# EasyEDA Pro project pcb easy eda pro stm32wb5mmg01 - Elektor.eprj, board PCB5
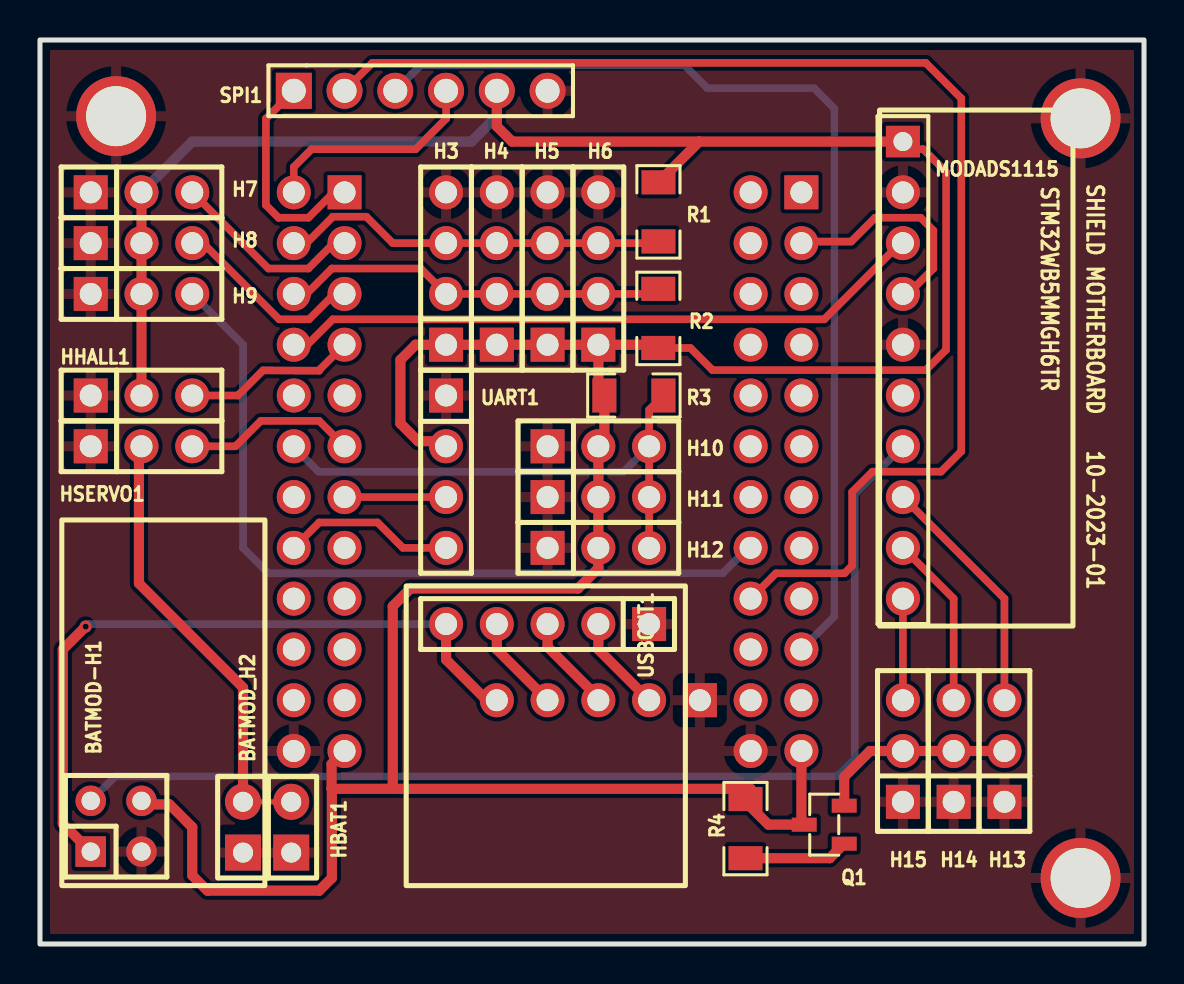
[diagram p5: board, top side]
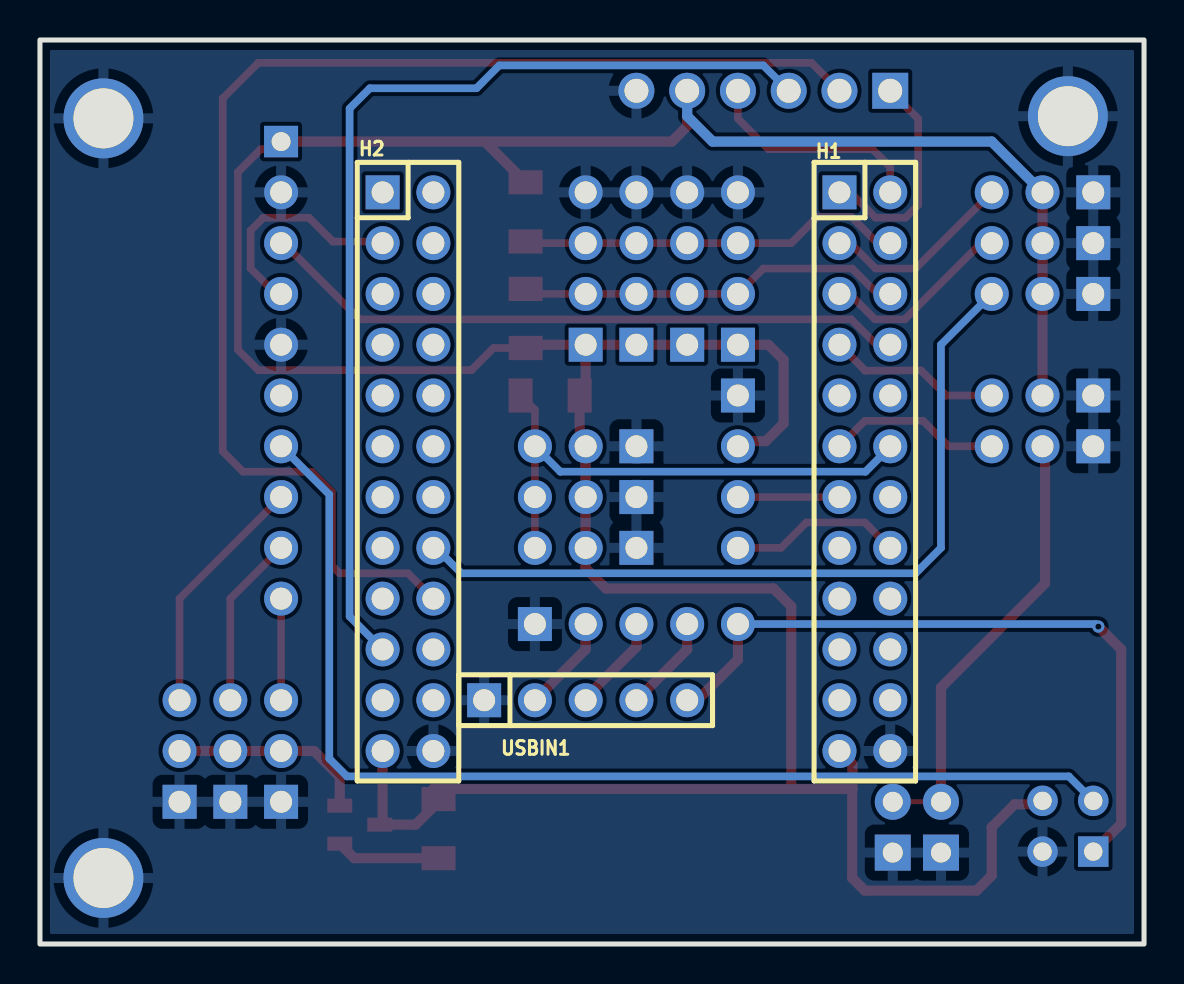
[diagram p6: board, bottom side, seen from below]

Outline 55.25 x 45.21 mm; copper layers: Top Layer, Bottom Layer. Coordinates in mm from the lower left corner of the outline.
Outline path: rectangle 0,45.21 55.25,0
Stack: Top Layer 0.035mm / Dielectric1 1.51mm FR4 er 4.5 / Bottom Layer 0.035mm

## Design rules (mm)
template: JLCPCB Capability(Two Layers Board)
spacing copperThickness1oz (default): track to track 0.102, other pairs 0.152 to 0.3
spacing copperThickness2oz: track to track 0.203, other pairs 0.152 to 0.3
track width copperThickness1oz (default): min 0.127, default 0.254, max 2.54
track width copperThickness2oz: min 0.203, default 0.254, max 2.54
differential pair differentialPair (default): width min 0.127, default 0.254, max 2.54; gap min 0.152, default 0.152
via viaSize (default): diameter min 0.5, default 0.61, max 10; hole min 0.3, default 0.305, max 6.3

## Placement (name value [footprint] x y rotation side)
BATMOD-H1  -  [HDR-TH_4P-P2.54-V-M-R2-C2-S2.54-1]  3.81 5.89 0 top
BATMOD_H2  -  [HDR-TH_2P-P2.54-V-M-1]  10.16 5.84 90 top
H1  PZ254-2-12-Z-8.5  [HDR-TH_24P-P2.54-V-M-R2-C12-S2.54]  13.97 23.62 270 bottom
H2  PZ254-2-12-Z-8.5  [HDR-TH_24P-P2.54-V-M-R2-C12-S2.54]  36.83 23.62 270 bottom
H3  -  [HDR-TH_4P-P2.54-V-M]  20.32 33.78 90 top
H4  -  [HDR-TH_4P-P2.54-V-M]  22.86 33.78 90 top
H5  -  [HDR-TH_4P-P2.54-V-M]  25.4 33.78 90 top
H6  -  [HDR-TH_4P-P2.54-V-M]  27.94 33.78 90 top
H7  -  [HDR-TH_3P-P2.54-V-M]  5.08 37.59 0 top
H8  -  [HDR-TH_3P-P2.54-V-M]  5.08 35.05 0 top
H9  -  [HDR-TH_3P-P2.54-V-M]  5.08 32.51 0 top
H10  -  [HDR-TH_3P-P2.54-V-M]  27.94 24.89 0 top
H11  -  [HDR-TH_3P-P2.54-V-M]  27.94 22.35 0 top
H12  -  [HDR-TH_3P-P2.54-V-M]  27.94 19.81 0 top
H13  -  [HDR-TH_3P-P2.54-V-M]  48.26 9.65 90 top
H14  -  [HDR-TH_3P-P2.54-V-M]  45.72 9.65 90 top
H15  -  [HDR-TH_3P-P2.54-V-M]  43.18 9.65 90 top
HBAT1  -  [HDR-TH_2P-P2.54-V-M-1]  12.57 5.84 90 top
HHALL1  -  [HDR-TH_3P-P2.54-V-M]  5.08 27.43 0 top
HSERVO1  -  [HDR-TH_3P-P2.54-V-M]  5.08 24.89 0 top
MODADS1115  -  [hdr-th_10p-p2.54-v-m-1]  43.18 28.7 270 top
NOREF  -  [Pad_e430]  3.81 41.4 90 top
NOREF#2  -  [Pad_e428]  52.07 3.3 90 top
NOREF#3  -  [Pad_e431]  52.07 41.29 90 top
Q1  CJ2301  [SOT-23-3_L2.9-W1.3-P1.90-LS2.4-BR]  39.24 5.97 0 top
R1  10kΩ  [R1206]  30.95 36.61 270 top
R2  10kΩ  [R1206]  30.94 31.29 90 top
R3  4.7kΩ  [R1206]  29.72 27.43 180 top
R4  10kΩ  [R1206]  35.3 5.77 90 top
SPI1  -  [HDR-TH_6P-P2.54-V-M-1]  19.05 42.67 0 top
UART1  -  [HDR-TH_4P-P2.54-V-M]  20.32 23.62 270 top
USBIN1  -  [HDR-TH_5P-P2.54-V-M]  27.94 12.19 180 bottom
USBOUT1  -  [HDR-TH_5P-P2.54-V-M]  25.4 16 180 top

## Footprints (pads in the part's own frame, mm; a bottom-side part is the same pattern mirrored in y, then rotated)
HDR-TH_2P-P2.54-V-M-1
  rect 1.8x1.8 hole 1: 1(-1.27,0)
  round 1.8 hole 1: 2(1.27,0)
HDR-TH_3P-P2.54-V-M
  rect 1.7x1.7 hole 1.1: 1(-2.54,0)
  round 1.7 hole 1.1: 2(0,0) 3(2.54,0)
HDR-TH_4P-P2.54-V-M
  rect 1.7x1.7 hole 1.1: 1(-3.81,0)
  round 1.7 hole 1.1: 2(-1.27,0) 3(1.27,0) 4(3.81,0)
HDR-TH_4P-P2.54-V-M-R2-C2-S2.54-1
  rect 1.524x1.524 hole 0.914: 1(-1.27,-1.27)
  round 1.524 hole 0.914: 2(-1.27,1.27) 3(1.27,-1.27) 4(1.27,1.27)
HDR-TH_5P-P2.54-V-M
  rect 1.7x1.7 hole 1.1: 1(-5.08,0)
  round 1.7 hole 1.1: 2(-2.54,0) 3(0,0) 4(2.54,0) 5(5.08,0)
HDR-TH_6P-P2.54-V-M-1
  rect 1.8x1.8 hole 1.2: 1(-6.35,0)
  round 1.8 hole 1.2: 2(-3.81,0) 3(-1.27,0) 4(1.27,0) 5(3.81,0) 6(6.35,0)
hdr-th_10p-p2.54-v-m-1
  rect 1.575x1.7 hole 0.945: 1(-11.43,0)
  round 1.7 hole 1.1: 2(-8.89,0) 3(-6.35,0) 4(-3.81,0) 5(-1.27,0) 6(1.27,0) 7(3.81,0) 8(6.35,0) 9(8.89,0) 10(11.43,0)
HDR-TH_24P-P2.54-V-M-R2-C12-S2.54
  rect 1.7x1.7 hole 1.1: 1(-13.97,-1.27)
  round 1.7 hole 1.1: 2(-13.97,1.27) 3(-11.43,-1.27) 4(-11.43,1.27) 5(-8.89,-1.27) 6(-8.89,1.27) 7(-6.35,-1.27) 8(-6.35,1.27) 9(-3.81,-1.27) 10(-3.81,1.27) 11(-1.27,-1.27) 12(-1.27,1.27) 13(1.27,-1.27) 14(1.27,1.27) 15(3.81,-1.27) 16(3.81,1.27) 17(6.35,-1.27) 18(6.35,1.27) 19(8.89,-1.27) 20(8.89,1.27) 21(11.43,-1.27) 22(11.43,1.27) 23(13.97,-1.27) 24(13.97,1.27)
Pad_e428
  round 4 hole 3: 1(0,0)
Pad_e430
  round 4 hole 3: 1(0,0)
Pad_e431
  round 4 hole 3: 1(0,0)
R1206
  rect 1.208x1.701 smd: 1(-1.479,0) 2(1.479,0)
SOT-23-3_L2.9-W1.3-P1.90-LS2.4-BR
  rect 1.25x0.7 smd: 1(1,-0.95) 2(1,0.95) 3(-1,0)

## Nets
As in the schematic, except:
GND: BATMOD-H1.3 BATMOD_H2.1 H1.24 H2.24 H3.4 H4.4 H5.4 H6.4 H7.1 H8.1 H9.1 H10.1 H11.1 H12.1 H13.1 H14.1 H15.1 HBAT1.1 HHALL1.1 HSERVO1.1 MODADS1115.2 MODADS1115.5 NOREF.1 NOREF#2.1 NOREF#3.1 SPI1.6 UART1.1 USBIN1.1 USBOUT1.1

## Via types
v1: diameter 0.61, hole 0.305, Top Layer to Bottom Layer, 1 via

## Routing (per net, layer and track width the routed paths; a pad name or vN(x,y) marks a point on that pad's centre or on a via; arc(x,y) is an arc through that point)
VBAT_IN: length 22.4
  Top Layer w0.254: BATMOD_H2.2 HBAT1.2
  Top Layer w0.508: HSERVO1.2 4.95,24.77 4.95,18.03 10.16,12.83 BATMOD_H2.2
VBUS: length 35.6
  Top Layer w0.508: USBIN1.5 22.35,12.19 20.32,14.22 USBOUT1.5 ; v1(2.29,15.88) 1.14,14.73 1.14,6.02 BATMOD-H1.1
  Bottom Layer w0.381: v1(2.29,15.88) 2.41,16 USBOUT1.5
VCC: length 182.3
  Top Layer w0.381: MODADS1115.1 43.56,39.75 44.2,39.75 45.34,38.61 45.34,29.72 44.32,28.7 33.66,28.7 32.55,29.81 R2.1
  Top Layer w0.508: SPI1.5 22.86,40.89 23.62,40.13 32.99,40.13 ; H6.1 27.94,27.73 28.24,27.43 28.24,25.19 H10.2 H11.2 H12.2 27.94,18.8 26.92,17.78 18.54,17.78 17.65,16.89 17.65,7.78 17.68,7.76 ; H6.1 30.78,29.97 R2.1 ; H6.1 H5.1 H4.1 H3.1 18.8,29.97 18.03,29.21 18.03,26.03 18.92,25.15 20.07,25.15 UART1.2 ; H2.23 38.1,6.11 Q1.3 36.45,5.97 35.56,6.86 35.56,7.76 17.68,7.76 ; 17.68,7.76 14.59,7.76 ; 32.99,40.13 MODADS1115.1 ; 32.99,40.13 R1.1 ; 14.59,7.76 14.6,7.75 14.6,3.3 13.97,2.67 8.38,2.67 7.62,3.43 7.62,5.84 6.48,6.98 5.26,6.98 BATMOD-H1.4 ; 14.59,7.76 14.59,9 H1.23 ; H7.2 H8.2 H9.2 HHALL1.2
  Bottom Layer w0.508: SPI1.5 22.86,41.4 21.59,40.13 7.62,40.13 H7.2
AIN1: length 12.3
  Top Layer w0.381: H13.3 48.26,17.27 MODADS1115.8
AIN2: length 8.7
  Top Layer w0.381: MODADS1115.9 45.72,17.27 H14.3
AIN3: length 5.1
  Top Layer w0.381: MODADS1115.10 H15.3
CMDVCAPT: length 5.2
  Top Layer w0.508: R4.1 39.52,4.29 40.24,5.02
D+: length 4.9
  Top Layer w0.508: USBOUT1.3 25.4,14.86 27.94,12.32 USBIN1.3
D-: length 4.9
  Top Layer w0.508: USBOUT1.4 22.86,14.73 USBIN1.4
I2C1_SCL: length 32.7
  Top Layer w0.381: H1.8 12.8,29.87 13.28,29.87 14.65,31.24 39.24,31.24 43.05,35.05 MODADS1115.3
I2C1_SDA: length 11.3
  Top Layer w0.381: H2.3 38.18,35.13 40.59,35.13 41.78,36.32 44.07,36.32 44.7,35.69 44.7,33.78 43.43,32.51 MODADS1115.4
I2C3_SCL: length 19.4
  Top Layer w0.381: R1.2 30.86,35.05 H6.3 H5.3 H4.3 H3.3 17.65,35.05 16.33,36.37 14.65,36.37 13.34,35.05 H1.4
I2C3_SDA: length 19.4
  Top Layer w0.381: H1.6 13.34,32.51 14.6,33.78 19.05,33.78 H3.2 H4.2 H5.2 H6.2 30.69,32.51 R2.2
IO: length 4.9
  Top Layer w0.508: USBIN1.2 27.94,14.73 USBOUT1.2
LPTIM2_IN1: length 40.1
  Bottom Layer w0.381: 35.43,19.81 34.16,18.54 11.43,18.54 10.16,19.81 10.16,29.97 H9.3
LPUART1_RX: length 8.7
  Top Layer w0.381: H1.16 13.97,21.08 16.89,21.08 18.16,19.81 UART1.4
LPUART1_TX: length 5.2
  Top Layer w0.381: UART1.3 15.11,22.35
PB0/ONEWIRE: length 26.8
  Top Layer w0.381: H12.3 H11.3 H10.3 30.48,26.72 R3.1
  Bottom Layer w0.381: H10.3 29.21,23.62 13.93,23.62 12.7,24.86 H1.12
PB1: length 8.7
  Top Layer w0.381: HSERVO1.3 9.78,24.89 11.05,26.16 13.97,26.16 H1.11
PB15: length 9.7
  Top Layer w0.381: H8.3 8.16,35.05 11.97,31.24 13.46,31.24 14.73,32.51 H1.5
PC6: length 9.7
  Top Layer w0.381: H1.3 14.7,35.05 13.43,33.78 11.43,33.78 H7.3
PC13: length 8.7
  Top Layer w0.381: H1.7 13.97,28.7 13.97,28.67 11.16,28.69 9.91,27.43 HHALL1.3
SPI2_CS: length 11.3
  Top Layer w0.381: H1.2 12.7,38.86 13.59,39.75 18.8,39.75 20.32,41.28 SPI1.4
SPI2_MISO: length 65.6
  Top Layer w0.381: H2.18 36.83,18.54 40.26,18.54 40.64,18.92 40.64,22.61 41.66,23.62 45.09,23.62 46.1,24.64 46.1,42.29 44.32,44.07 16.64,44.07 SPI1.2
SPI2_MOSI: length 51.1
  Bottom Layer w0.381: H2.19 39.75,16.38 39.75,41.78 38.73,42.8 33.4,42.8 32.26,43.94 19.05,43.94 SPI1.3
SPI2_SCK: length 11
  Top Layer w0.381: SPI1.1 11.3,41.28 11.3,36.96 11.94,36.32 13.43,36.32 14.7,37.59 H1.1
VCAPT: length 10
  Top Layer w0.508: H13.2 H14.2 H15.2 41.53,9.65 40.24,8.37 Q1.2
VSENS: length 55.7
  Bottom Layer w0.381: BATMOD-H1.2 3.76,8.38 39.88,8.38 40.77,9.27 40.77,22.48 MODADS1115.7

## Copper pours and planes (outline as drawn; the poured copper is in the pictures)
GND on Top Layer: 0,45.21 55.25,45.21 55.25,0 0,0
GND on Bottom Layer: 0,45.21 55.25,45.21 55.25,0 0,0

## Text on the board
Document Layer: GND/VCC/PC6 / GND/VCC/PB15 / GND/VCC/LPTIM2_IN1 | GND/VCC/PC13 / GND/VBATIN/PB1 | AIN3/AIN2/AIN1 / VCAPT / GND | GND/GND/GND/GND / SCL/SCL/SCL/SCL / SDA/SDA/SDA/SDA / VCC/VCC/VCC/VCC | GND / VCC / LPUART1_TX / LPUART1_RX | GND/VCC/PB0 ONEWIRE / GND/VCC/PB0 ONEWIRE / GND/VCC/PB0 ONEWIRE | SPI2_SCK / SPI2_MISO / SPI2_MOSI / SPI2_CS / VCC / GND | USB VBUS / D- / D+ / IO / GND | STM32WB55MMG MB
Top Silkscreen Layer: STM32WB5MMGH6TR | SHIELD MOTHERBOARD | 10-2023-01
